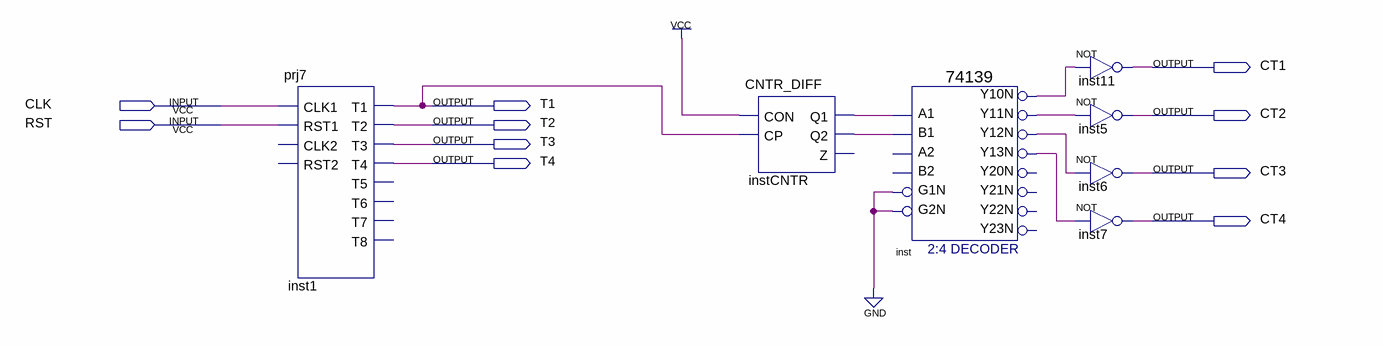
[diagram p0: schematic sheet]
// Quartus schematic proj3_testClock.bdf as structural Verilog: 7 symbols, 10 pins
module proj3_testClock (
  input  CLK,
  input  RST,
  output CT1,
  output T1,
  output CT2,
  output T2,
  output T3,
  output T4,
  output CT3,
  output CT4
);

  wire inst_y10n, inst_y11n, inst_y12n, inst_y13n, instCNTR_q1, instCNTR_q2;

  prj7 inst1 (.CLK1(CLK), .RST1(RST), .T1(T1), .T2(T2), .T3(T3), .T4(T4));  // open: CLK2, RST2, T5, T6, T7, T8
  CNTR_DIFF instCNTR (.CON(1'b1), .CP(T1), .Q1(instCNTR_q1), .Q2(instCNTR_q2));  // open: Z
  \74139  inst (
    .A1(instCNTR_q1), .B1(instCNTR_q2), .G1N(1'b0), .G2N(1'b0), .Y10N(inst_y10n), .Y13N(inst_y13n),
    .Y12N(inst_y12n), .Y11N(inst_y11n));  // open: A2, B2, Y20N, Y21N, Y22N, Y23N
  not inst11 (CT1, inst_y10n);
  not inst5 (CT2, inst_y11n);
  not inst6 (CT3, inst_y12n);
  not inst7 (CT4, inst_y13n);
endmodule
